# Altium schematic sheet Relay_Control.SchDoc
size Tabloid; SheetNumber: 6; SheetTotal: 13
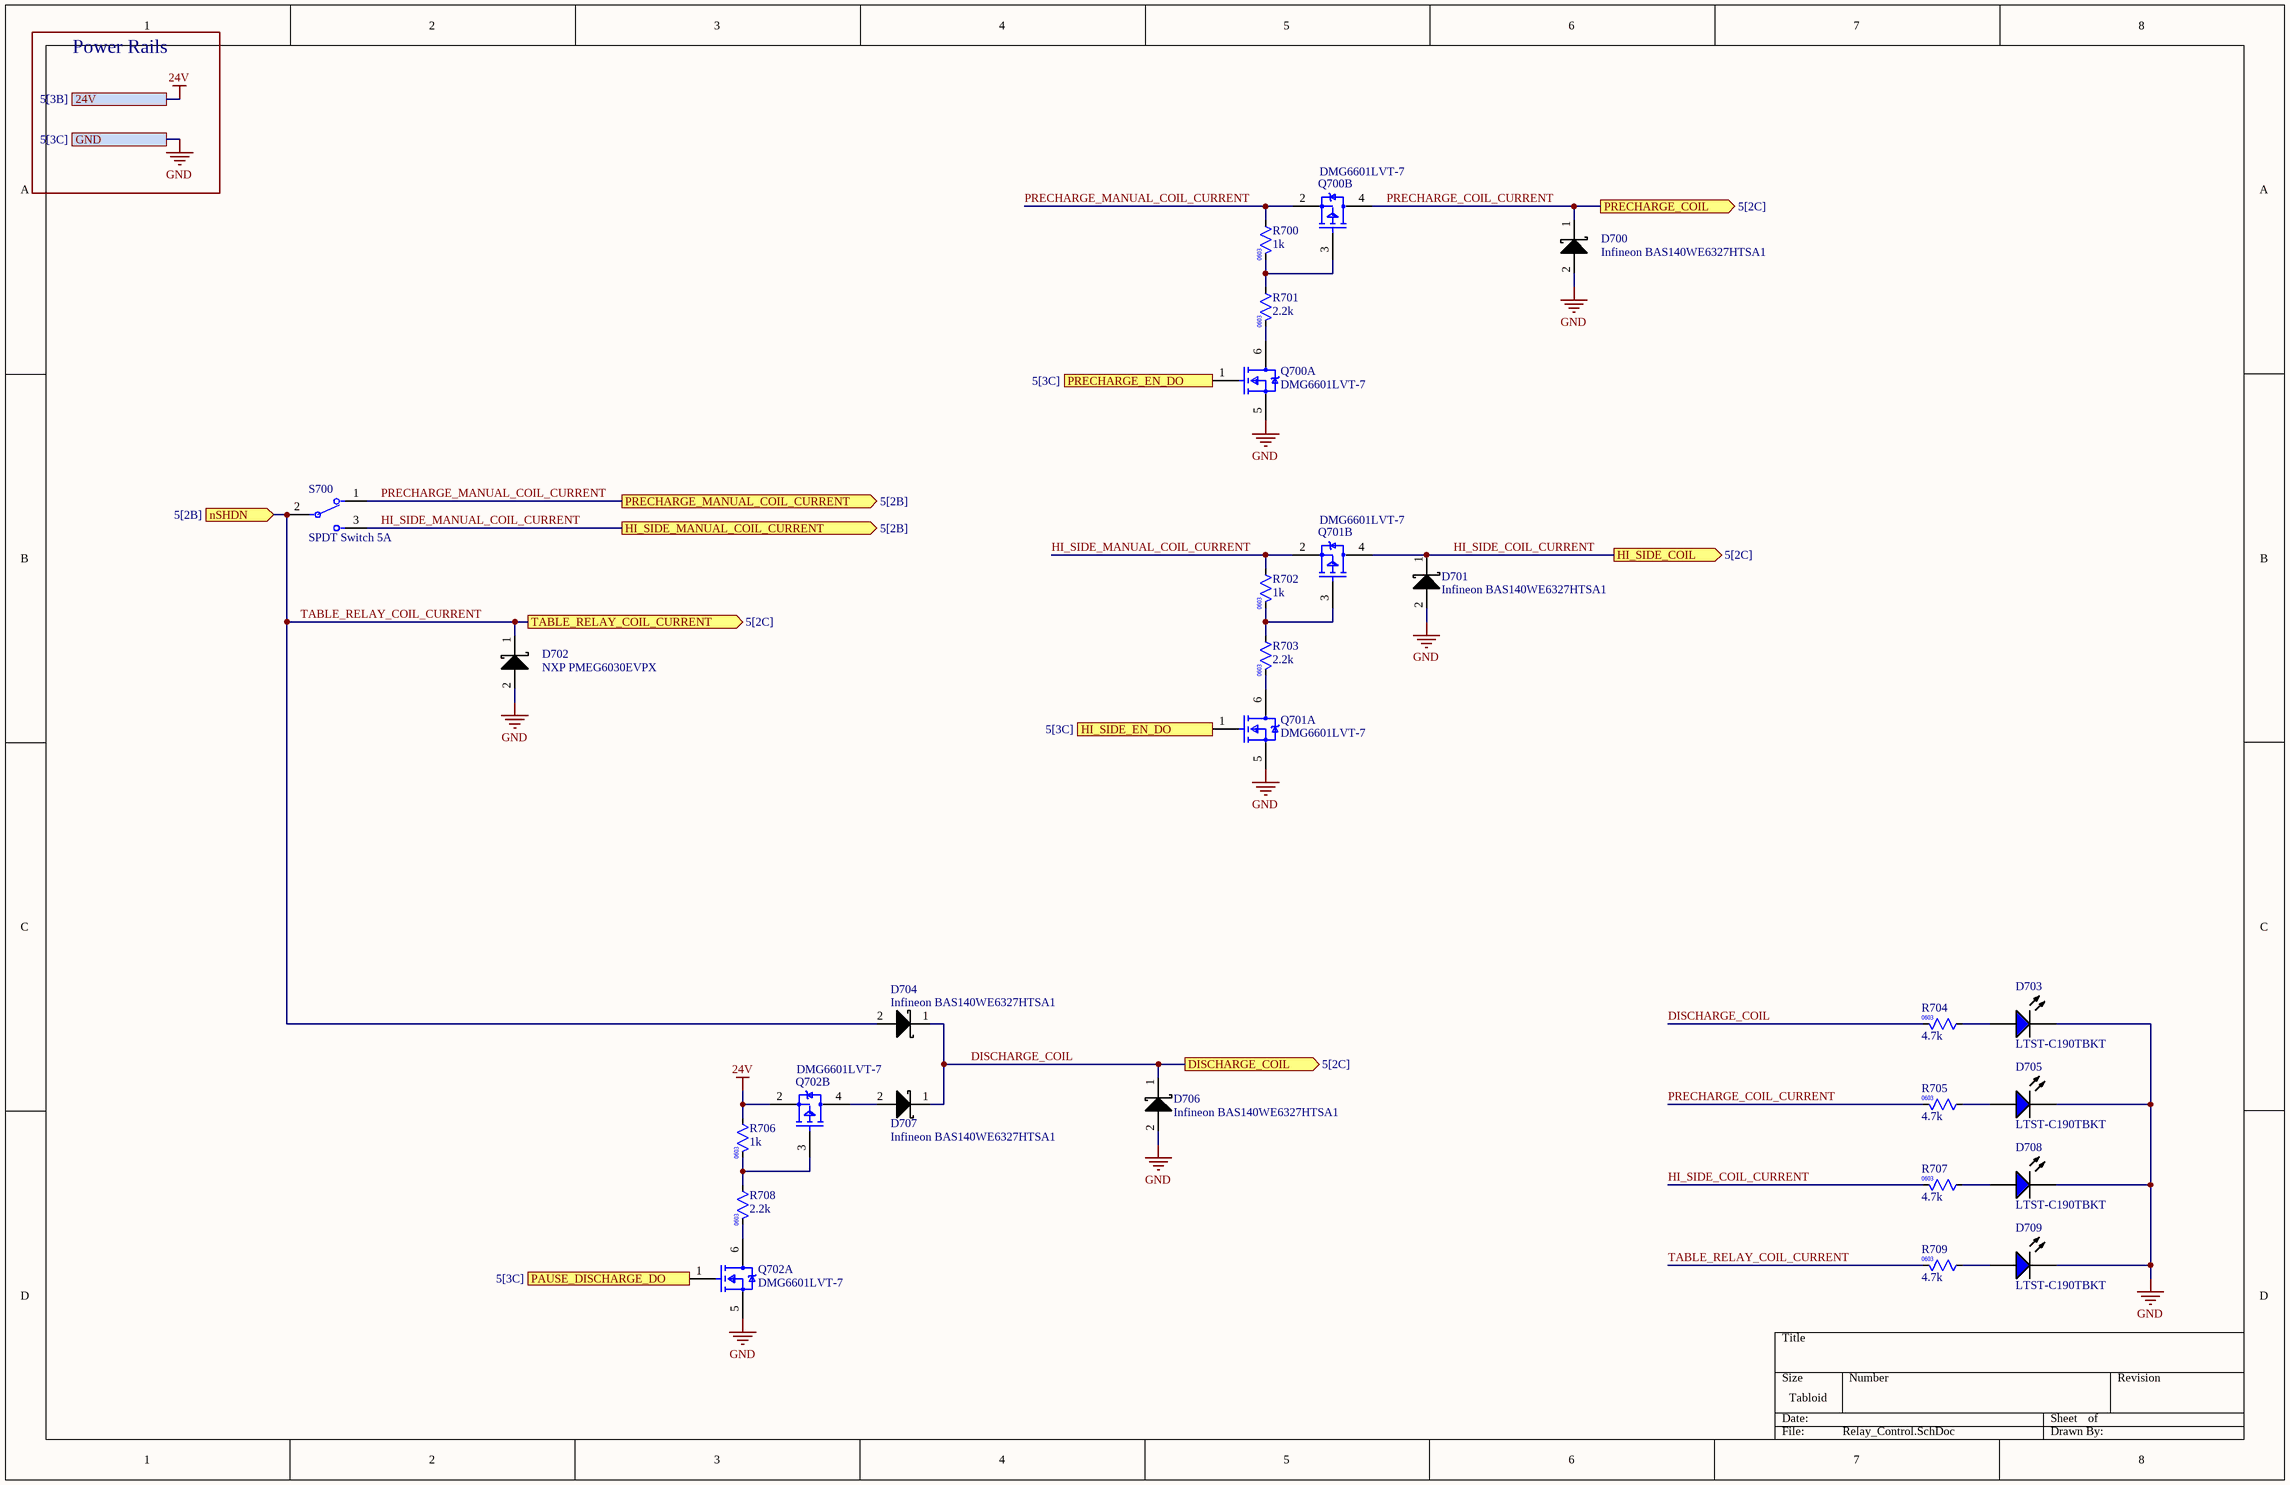
[diagram p0: Relay_Control.SchDoc]

## Parts
D700  Infineon BAS140WE6327HTSA1  [INFINEON BAS140W SERIES]
D701  Infineon BAS140WE6327HTSA1  [INFINEON BAS140W SERIES]
D702  NXP PMEG6030EVPX  [NXP PMEG6030EVPX]
D703  LTST-C190TBKT  [LTST-C190TBKT-2_V]
D704  Infineon BAS140WE6327HTSA1  [INFINEON BAS140W SERIES]
D705  LTST-C190TBKT  [LTST-C190TBKT-2_V]
D706  Infineon BAS140WE6327HTSA1  [INFINEON BAS140W SERIES]
D707  Infineon BAS140WE6327HTSA1  [INFINEON BAS140W SERIES]
D708  LTST-C190TBKT  [LTST-C190TBKT-2_V]
D709  LTST-C190TBKT  [LTST-C190TBKT-2_V]
Q700  DMG6601LVT-7  [FP-TSOT26-IPC_A]  (parts A,B of 2)
Q701  DMG6601LVT-7  [FP-TSOT26-IPC_A]  (parts A,B of 2)
Q702  DMG6601LVT-7  [FP-TSOT26-IPC_A]  (parts A,B of 2)
R700  value 1k  [0603 Resistor Footprint]  (hidden comment: 0603 1k 1% 0.33W)
R701  value 2.2k  [0603 Resistor Footprint]  (hidden comment: 0603 2k2 1% 0.25W)
R702  value 1k  [0603 Resistor Footprint]  (hidden comment: 0603 1k 1% 0.33W)
R703  value 2.2k  [0603 Resistor Footprint]  (hidden comment: 0603 2k2 1% 0.25W)
R704  value 4.7k  [0603 Resistor Footprint]  (hidden comment: 0603 4k7 1% 0.33W)
R705  value 4.7k  [0603 Resistor Footprint]  (hidden comment: 0603 4k7 1% 0.33W)
R706  value 1k  [0603 Resistor Footprint]  (hidden comment: 0603 1k 1% 0.33W)
R707  value 4.7k  [0603 Resistor Footprint]  (hidden comment: 0603 4k7 1% 0.33W)
R708  value 2.2k  [0603 Resistor Footprint]  (hidden comment: 0603 2k2 1% 0.25W)
R709  value 4.7k  [0603 Resistor Footprint]  (hidden comment: 0603 4k7 1% 0.33W)
S700  SPDT Switch 5A  [SPDT 5A]

## Ports
24V (see 5[3B]), DISCHARGE_COIL (out, see 5[2C]), GND (see 5[3C]), HI_SIDE_COIL (out, see 5[2C]), HI_SIDE_EN_DO (in, see 5[3C]), HI_SIDE_MANUAL_COIL_CURRENT (out, see 5[2B]), nSHDN (in, see 5[2B]), PAUSE_DISCHARGE_DO (in, see 5[3C]), PRECHARGE_COIL (out, see 5[2C]), PRECHARGE_EN_DO (in, see 5[3C]), PRECHARGE_MANUAL_COIL_CURRENT (out, see 5[2B]), TABLE_RELAY_COIL_CURRENT (out, see 5[2C])

## Nets
24V: Q702.2(S2) R706.1 ; port 24V
GND: D700.2 D701.2 D702.2 D703.2(K) D705.2(K) D706.2 D708.2(K) D709.2(K) Q700.5(S1) Q701.5(S1) Q702.5(S1) ; port GND
DISCHARGE_COIL: D704.1 D706.1 D707.1 R704.2 ; port DISCHARGE_COIL
HI_SIDE_COIL_CURRENT: D701.1 Q701.4(D2) R707.2 ; port HI_SIDE_COIL
HI_SIDE_EN_DO: Q701.1(G1) ; port HI_SIDE_EN_DO
HI_SIDE_MANUAL_COIL_CURRENT: Q701.2(S2) R702.1 S700.3 ; port HI_SIDE_MANUAL_COIL_CURRENT
PAUSE_DISCHARGE_DO: Q702.1(G1) ; port PAUSE_DISCHARGE_DO
PRECHARGE_COIL_CURRENT: D700.1 Q700.4(D2) R705.2 ; port PRECHARGE_COIL
PRECHARGE_EN_DO: Q700.1(G1) ; port PRECHARGE_EN_DO
PRECHARGE_MANUAL_COIL_CURRENT: Q700.2(S2) R700.1 S700.1 ; port PRECHARGE_MANUAL_COIL_CURRENT
TABLE_RELAY_COIL_CURRENT: D702.1 D704.2 R709.2 S700.2 ; port nSHDN, port TABLE_RELAY_COIL_CURRENT
NetD703_1: D703.1(A) R704.1
NetD705_1: D705.1(A) R705.1
NetD707_2: D707.2 Q702.4(D2)
NetD708_1: D708.1(A) R707.1
NetD709_1: D709.1(A) R709.1
NetQ700_3: Q700.3(G2) R700.2 R701.1
NetQ700_6: Q700.6(D1) R701.2
NetQ701_3: Q701.3(G2) R702.2 R703.1
NetQ701_6: Q701.6(D1) R703.2
NetQ702_3: Q702.3(G2) R706.2 R708.1
NetQ702_6: Q702.6(D1) R708.2

## Notes on the sheet
- Power Rails
- (in symbol CMP-009-00190-8) 0603

## Library data of the parts
D700 D701 D704 D706 D707 = CMP-024-000030-1: DIODE SCHOTTKY 40V 120MA SOD323; Supplier Part Number 1: BAS140WE6327HTSA1CT-ND; Source: UBC Formula Electric.SchLib; Supplier 1: Digi-Key; Design Item ID: Infineon BAS140WE6327HTSA1
D702 = CMP-011-0009-1: Diode Schottky 60V 3A Surface Mount SOD-128/CFP5; Source: Quad_Inverter.SchLib; Design Item ID: NXP PMEG6030EVPX; Component Type: Standard; Pins: 2
D703 D705 D708 D709 = CMP-007-00026-2: LED Uni-Color Blue, 76 mW, 20 mA, -20 to 80 degC, 2-Pin SMD, RoHS, Tape and Reel; Manufacturer: Lite-On; Viewing Angle: 130degrees; Luminous Intensity: 28mcd; Forward Voltage: 2.8V; Forward Current: 20mA; Lens Style: Diffused; Nominal Vf: 3.3V; Colour: Blue; Packaging: TapeandReel; Datasheet Version: Rev. K, 08/2011; Min Operating Temperature: -20°C; Package Quantity: 3000; Mounting Technology: SM; RoHS Compliant: True; Max Operating Temperature: 80°C; Package Description: 2-Pin Surface Mount Device, Body 1.6 x 0.8 mm; Pins: 2; Illumination Colour: Blue; Manufacturer URL: http://www.us.liteon.com/; Case/Package: 0603; Package Reference: C190TBKT-2; Datasheet URL: http://optoelectronics.liteon.com/upload/download/DS-22-99-0224/S_110_LTST-C190TBKT(0630).pdf
Q700-Q702 = CMP-013-00034-1: Small Signal Field-Effect Transistor, 3.8A I(D), 30V, 2-Element, N-Channel and P-Channel, Silicon, Metal-oxide Semiconductor FET; RoHS Compliant: Yes; Pins: 6
R700 R702 R706 = CMP-009-00184-7: RES SMD 1K OHM 1% 1/3W 0603; Manufacturer Part Number: CRCW06031K00FKEAHP; Power: 250mW; Max Operating Temperature: 155°C; RoHS Compliant: Yes; Pins: 2; Case/Package: 0603; Tolerance: 1%; Mounting Technology: Surface Mount; Min Operating Temperature: -55°C; Digikey Part Number: 541-1.00KSCT-ND
R701 R703 R708 = CMP-009-00190-8: RES SMD 2.2K OHM 1% 1/4W 0603; Manufacturer Part Number: RCS06032K20FKEA; Digikey Part Number: 541-10449-1-ND
R704 R705 R707 R709 = CMP-009-00182-7: RES SMD 4.7K OHM 1% 1/3W 0603; Manufacturer Part Number: CRCW06034K70FKEAHP; Power: 250mW; Tolerance: 1%; Case/Package: 0603; Pins: 2; RoHS Compliant: Yes; Min Operating Temperature: -55°C; Mounting Technology: Surface Mount; Digikey Part Number: 541-4.70KSCT-ND; Max Operating Temperature: 155°C